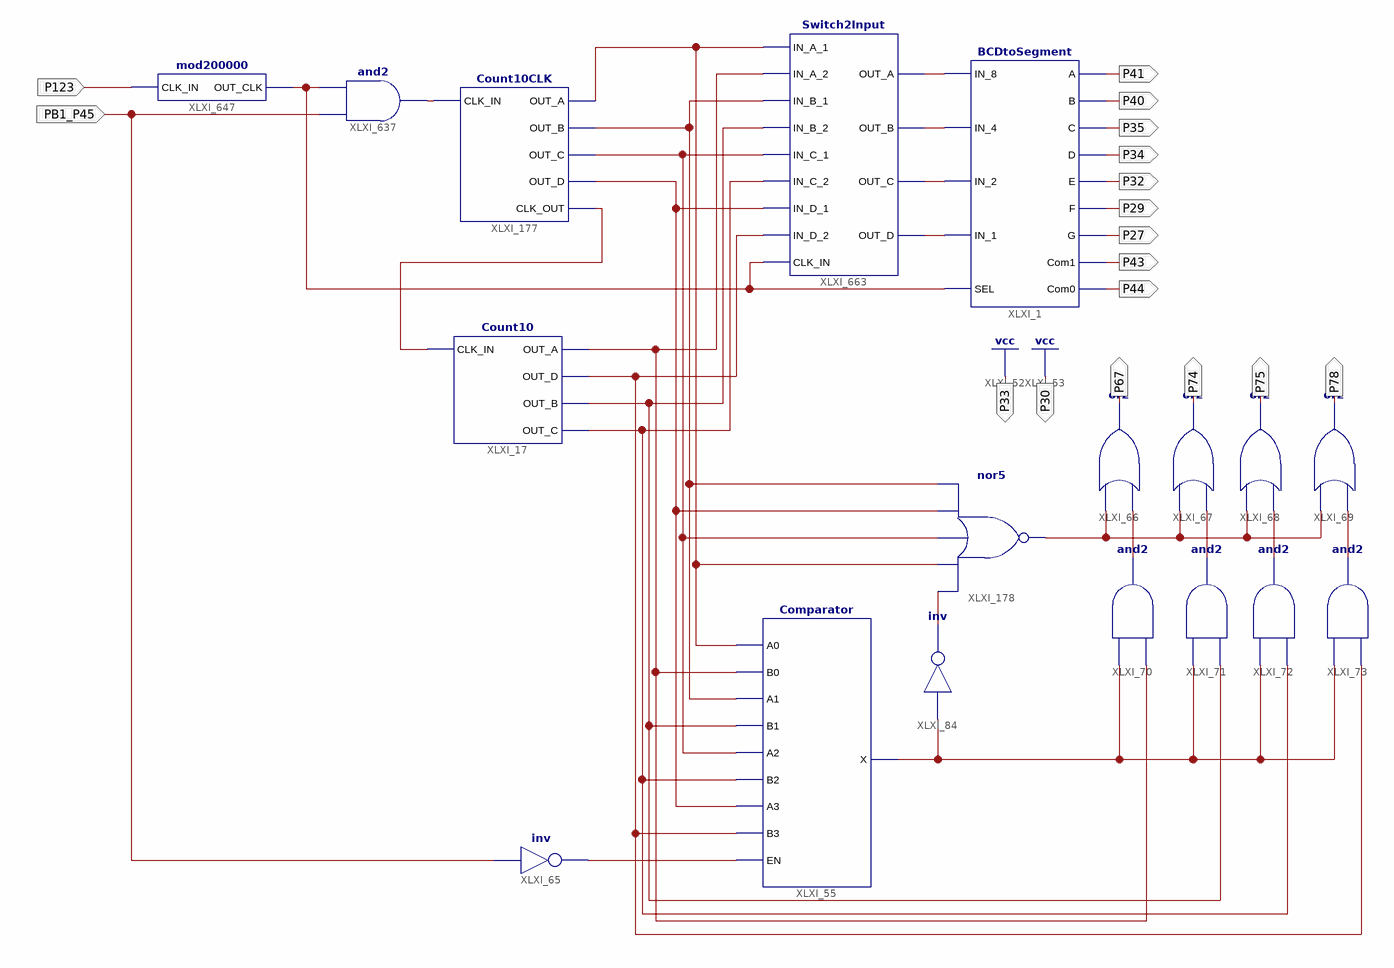
[diagram p0: schematic sheet 1]
// Xilinx ISE schematic Lab6.sch (spartan6) as structural Verilog: 18 symbols, 17 ports
module Lab6 (
  input  PB1_P45,
  input  P123,
  output P30,
  output P33,
  output P44,
  output P43,
  output P27,
  output P29,
  output P32,
  output P34,
  output P35,
  output P40,
  output P41,
  output P78,
  output P74,
  output P67,
  output P75
);

  wire A_P78, B_P75, C_P74, D_P67, XLXN_37, XLXN_40, XLXN_41, XLXN_42, XLXN_55, XLXN_198, XLXN_203, XLXN_204,
       XLXN_214, XLXN_379, XLXN_416, XLXN_1094, XLXN_1188, XLXN_1189, XLXN_1191, XLXN_1491, XLXN_1495,
       XLXN_1500, XLXN_1503;

  not XLXI_65 (XLXN_198, PB1_P45);
  Count10CLK XLXI_177 (
    .CLK_IN(XLXN_416), .OUT_B(D_P67), .OUT_C(B_P75), .CLK_OUT(XLXN_1094), .OUT_D(C_P74), .OUT_A(A_P78));
  and XLXI_637 (XLXN_416, PB1_P45, XLXN_1188);
  mod200000 XLXI_647 (.CLK_IN(P123), .OUT_CLK(XLXN_1188));
  Count10 XLXI_17 (.CLK_IN(XLXN_1094), .OUT_D(XLXN_1191), .OUT_B(XLXN_379), .OUT_C(XLXN_55), .OUT_A(XLXN_1189));
  Switch2Input XLXI_663 (
    .IN_A_1(A_P78), .CLK_IN(XLXN_1188), .IN_B_1(D_P67), .IN_A_2(XLXN_1189), .IN_B_2(XLXN_379),
    .IN_C_1(B_P75), .IN_C_2(XLXN_55), .IN_D_2(XLXN_1191), .IN_D_1(C_P74), .OUT_A(XLXN_42), .OUT_B(XLXN_41),
    .OUT_C(XLXN_40), .OUT_D(XLXN_37));
  BCDtoSegment XLXI_1 (
    .IN_8(XLXN_42), .IN_4(XLXN_41), .IN_2(XLXN_40), .IN_1(XLXN_37), .A(P41), .B(P40), .C(P35), .D(P34),
    .E(P32), .F(P29), .G(P27), .Com1(P43), .Com0(P44), .SEL(XLXN_1188));
  Comparator XLXI_55 (
    .B0(XLXN_1189), .A1(D_P67), .B1(XLXN_379), .A2(B_P75), .B3(XLXN_1191), .EN(XLXN_198), .A0(A_P78),
    .A3(C_P74), .B2(XLXN_55), .X(XLXN_204));
  not XLXI_84 (XLXN_214, XLXN_204);
  nor XLXI_178 (XLXN_1500, XLXN_214, A_P78, B_P75, C_P74, D_P67);
  or XLXI_66 (P67, XLXN_1491, XLXN_1500);
  and XLXI_70 (XLXN_1491, XLXN_1189, XLXN_204);
  or XLXI_67 (P74, XLXN_1495, XLXN_1500);
  and XLXI_71 (XLXN_1495, XLXN_379, XLXN_204);
  or XLXI_68 (P75, XLXN_1503, XLXN_1500);
  or XLXI_69 (P78, XLXN_203, XLXN_1500);
  and XLXI_73 (XLXN_203, XLXN_1191, XLXN_204);
  and XLXI_72 (XLXN_1503, XLXN_55, XLXN_204);

  assign P30 = 1'b1;
  assign P33 = 1'b1;
endmodule
